# EAGLE schematic rev_001 (EAGLE 9.6.2)
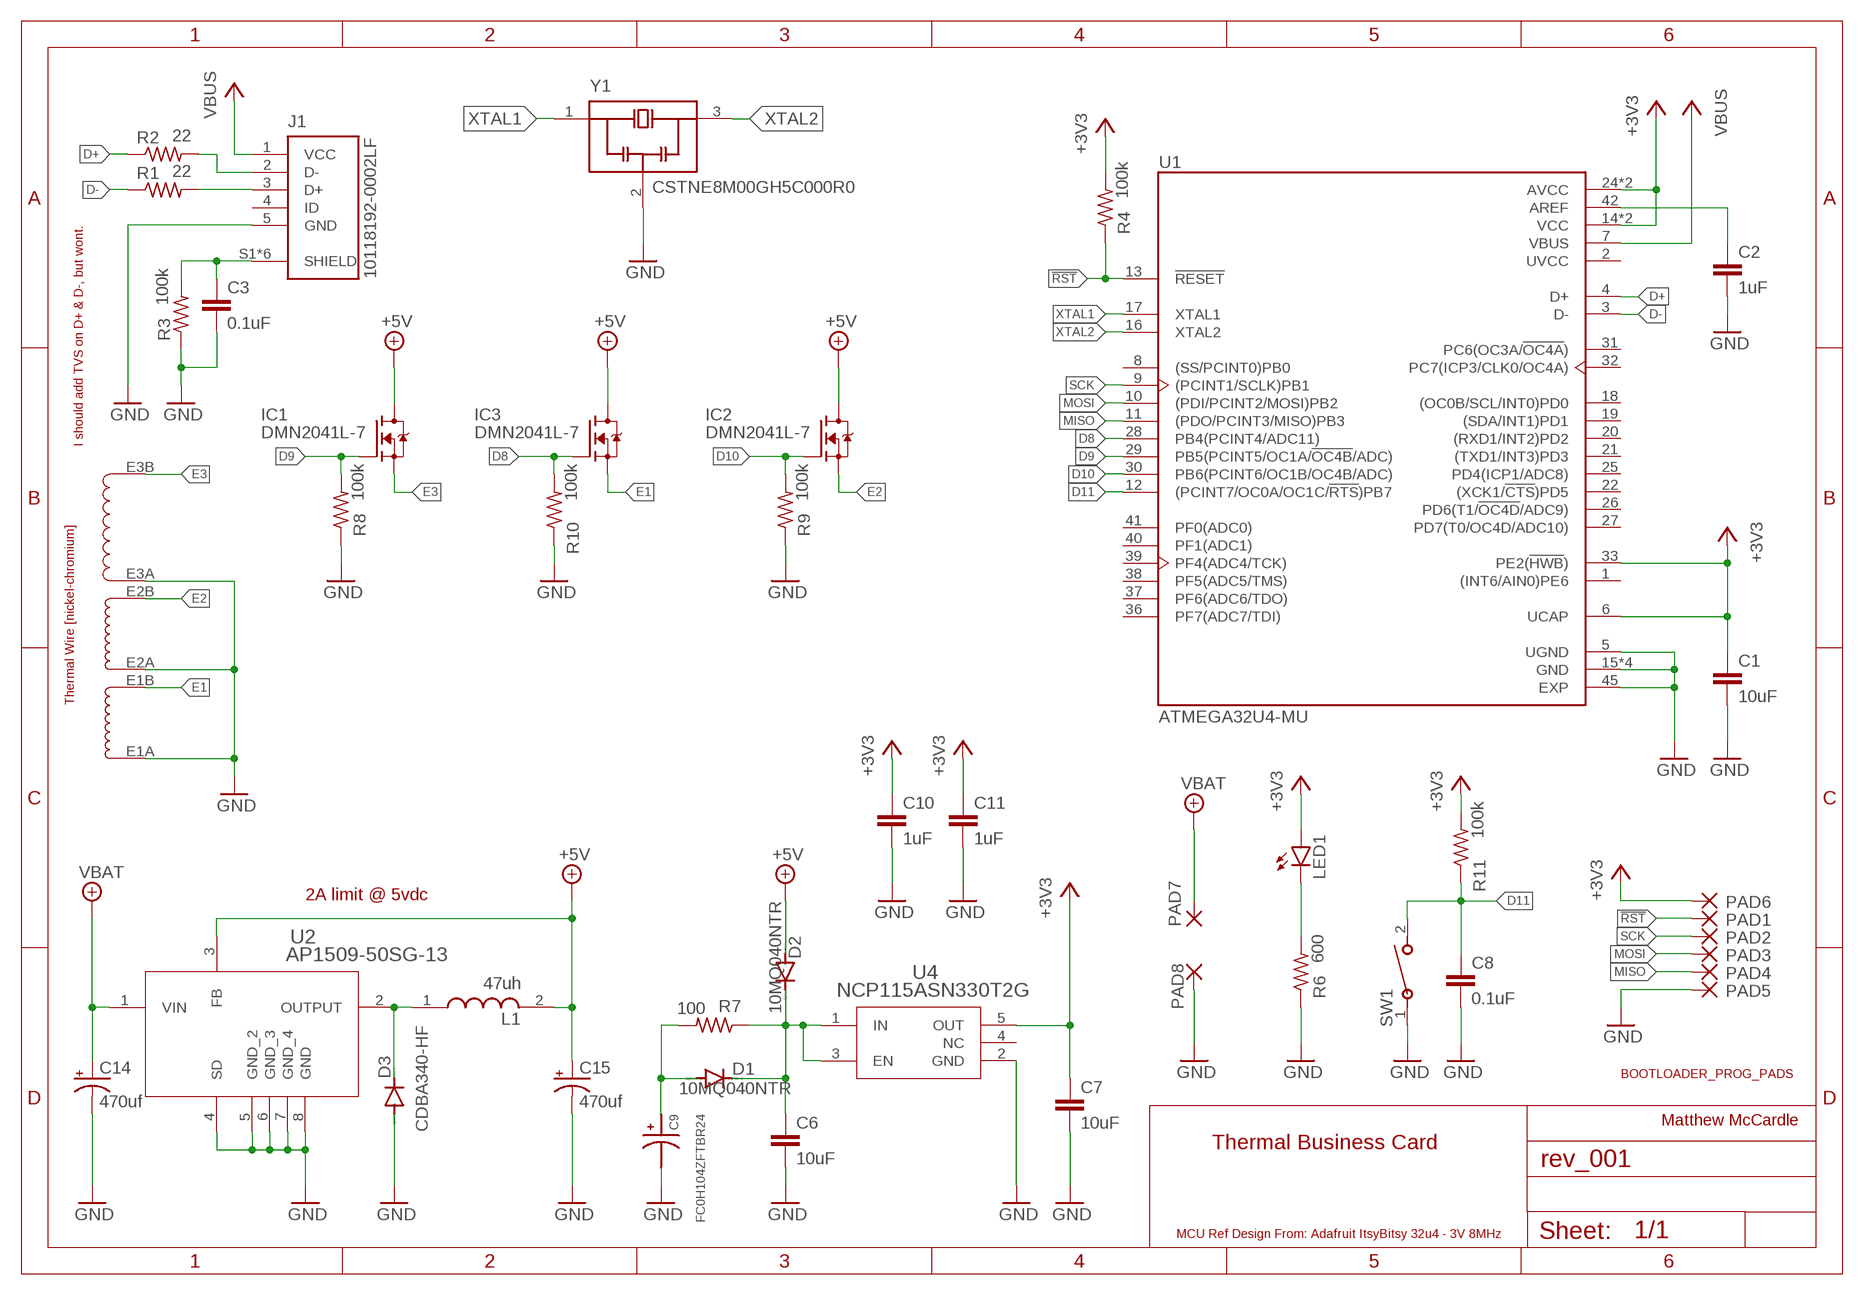
[diagram p0: schematic, sheet 1]

## Parts
C1  10uF  C-EUC0603  [C0603]
C2  1uF  C-EUC0603  [C0603]
C3  0.1uF  C-EUC0603  [C0603]
C6  10uF  C-EUC0603  [C0603]
C7  10uF  C-EUC0603  [C0603]
C8  0.1uF  C-EUC0603  [C0603]
C9  FC0H104ZFTBR24  [CAPAE1080X580N]
C10  1uF  C-EUC0603  [C0603]
C11  1uF  C-EUC0603  [C0603]
C14  470uf  CPOL-USUD-4X5,8  [UD-4X5,8_NICHICON]
C15  470uf  CPOL-USUD-4X5,8  [UD-4X5,8_NICHICON]
D1  10MQ040NTR  DIODE-DO-214AC  [DO-214AC]
D2  10MQ040NTR  DIODE-DO-214AC  [DO-214AC]
D3  CDBA340-HF  DIODE-DO-214AC  [DO-214AC]
IC1  DMN2041L-7  DS31126  [SOT23]
IC2  DMN2041L-7  DS31126  [SOT23]
IC3  DMN2041L-7  DS31126  [SOT23]
J1  10118192-0002LF  [AMPHENOL_10118192-0002LF]
L1  47uh  WUERTH_ELEKTRONIK_7447714470WUERTH_ELEKTRONIK_7447714470_0_0  [WUERTH_ELEKTRONIK_7447714470_0]
LED1  LEDSML0603  [SML0603]
NICR1  HOT_WIRE  [LAYOUT_A]
PAD1  WIREPADSMD1,27-254  [SMD1,27-2,54]
PAD2  WIREPADSMD1,27-254  [SMD1,27-2,54]
PAD3  WIREPADSMD1,27-254  [SMD1,27-2,54]
PAD4  WIREPADSMD1,27-254  [SMD1,27-2,54]
PAD5  WIREPADSMD1,27-254  [SMD1,27-2,54]
PAD6  WIREPADSMD1,27-254  [SMD1,27-2,54]
PAD7  WIREPAD2,54/0,9  [2,54/0,9]
PAD8  WIREPAD2,54/0,9  [2,54/0,9]
R1  22  R-US_R0603  [R0603]
R2  22  R-US_R0603  [R0603]
R3  100k  R-US_R0603  [R0603]
R4  100k  R-US_R0603  [R0603]
R6  600  R-US_R0603  [R0603]
R7  100  R-US_R0603  [R0603]
R8  100k  R-US_R0603  [R0603]
R9  100k  R-US_R0603  [R0603]
R10  100k  R-US_R0603  [R0603]
R11  100k  R-US_R0603  [R0603]
SW1  B3AL-1000P  [SW_B3AL_OMR]
U1  ATMEGA32U4-MU  [QFN50P700X700X100-45N]
U2  AP1509-50SG-13  [SOP-8L_DIO]
U4  NCP115ASN330T2G  [TSOP-5-483-N_ONS]
Y1  CSTNE8M00GH5C000R0  [OSC_CSTNE8M00GH5C000R0]

## Nets
!RST: PAD1.1(P) R4.1 U1.13(!RESET!)
+3V3: C1.1 C7.1 C10.1 C11.1 LED1.A PAD6.1(P) R4.2 R11.2 U1.6(UCAP) U1.14(VCC) U1.24(AVCC) U1.33(PE2(!HWB!)) U1.34(VCC) U1.44(AVCC) U4.5(OUT)
+5V: C15.+ D2.A IC1.D IC2.D IC3.D J1.1(VCC) L1.2 U1.7(VBUS) U2.3(FB) ; supply symbol labelled VBUS
+8V: C14.+ PAD7.1(P) U2.1(VIN) ; supply symbol labelled VBAT
D8: IC3.G R10.2 U1.28(PB4(PCINT4/ADC11))
D9: IC1.G R8.2 U1.29(PB5(PCINT5/OC1A/!OC4B!/ADC))
D10: IC2.G R9.2 U1.30(PB6(PCINT6/OC1B/OC4B/ADC))
D11: C8.1 R11.1 SW1.2 U1.12((PCINT7/OC0A/OC1C/!RTS!)PB7)
D+: R2.1 U1.4(D+)
D-: R1.1 U1.3(D-)
E1: IC3.S NICR1.E1B
E2: IC2.S NICR1.E2B
E3: IC1.S NICR1.E3B
GND: C1.2 C2.2 C3.2 C6.2 C7.2 C8.2 C9.2 C10.2 C11.2 C14.- C15.- D3.A J1.5(GND) NICR1.E1A NICR1.E2A NICR1.E3A PAD5.1(P) PAD8.1(P) R3.1 R6.1 R8.1 R9.1 R10.1 SW1.1 U1.5(UGND) U1.15(GND) U1.23(GND) U1.35(GND) U1.43(GND) U1.45(EXP) U2.4(SD) U2.5(GND_2) U2.6(GND_3) U2.7(GND_4) U2.8(GND) U4.2(GND) Y1.2(GND)
MISO: PAD4.1(P) U1.11((PDO/PCINT3/MISO)PB3)
MOSI: PAD3.1(P) U1.10((PDI/PCINT2/MOSI)PB2)
N$1: J1.3(D+) R1.2
N$2: C2.1 U1.42(AREF)
N$3: J1.2(D-) R2.2
N$4: C3.1 J1.S1(SHIELD) J1.S2(SHIELD) J1.S3(SHIELD) J1.S4(SHIELD) J1.S5(SHIELD) J1.S6(SHIELD) R3.2
N$6: LED1.C R6.2
N$7: D3.C L1.1 U2.2(OUTPUT)
N$9: C9.1 D1.A R7.2
N$10: C6.1 D1.C D2.C R7.1 U4.1(IN) U4.3(EN)
SCK: PAD2.1(P) U1.9((PCINT1/SCLK)PB1)
XTAL1: U1.17(XTAL1) Y1.1(IN)
XTAL2: U1.16(XTAL2) Y1.3(OUT)
Unconnected: J1.4(ID) U1.1((INT6/AIN0)PE6) U1.8((SS/PCINT0)PB0) U1.18((OC0B/SCL/INT0)PD0) U1.19((SDA/INT1)PD1) U1.20((RXD1/INT2)PD2) U1.21((TXD1/INT3)PD3) U1.22((XCK1/!CTS!)PD5) U1.25(PD4(ICP1/ADC8)) U1.26(PD6(T1/!OC4D!/ADC9)) U1.27(PD7(T0/OC4D/ADC10)) U1.31(PC6(OC3A/!OC4A!)) U1.32(PC7(ICP3/CLK0/OC4A)) U1.36(PF7(ADC7/TDI)) U1.37(PF6(ADC6/TDO)) U1.38(PF5(ADC5/TMS)) U1.39(PF4(ADC4/TCK)) U1.40(PF1(ADC1)) U1.41(PF0(ADC0)) U4.4(NC)

## Notes on the sheet
- I should add TVS on D+ & D-, but wont.
- Thermal Wire [nickel-chromium]
- 2A limit @ 5vdc
- BOOTLOADER_PROG_PADS
- Matthew McCardle
- Thermal Business Card
- MCU Ref Design From: Adafruit ItsyBitsy 32u4 - 3V 8MHz

## Power pins joined to a net without a drawn wire
UVCC: U1.2(UVCC)

## Library data of the parts
C1-C3 C6-C8 C10 C11 = rcl:C-EU: CAPACITOR, European symbol; SPICEPREFIX: C
C9 = FC0H104ZFTBR24:FC0H104ZFTBR24: 100mF (EDLC) Supercapacitor 5.5V Radial, Can - SMD 25Ohm @ 1kHz; DESCRIPTION: 100 mF (EDLC) Supercapacitor 5.5 V Radial, Can - SMD 25Ohm @ 1kHz -; DIGI-KEY_PART_NUMBER: 399-10939-1-ND; MF: KEMET; MP: FC0H104ZFTBR24; PACKAGE: Radial KEMET; PURCHASE-URL: https://pricing.snapeda.com/search/part/FC0H104ZFTBR24/?ref=eda
C14 C15 = rcl:CPOL-US: POLARIZED CAPACITOR, American symbol; SPICEPREFIX: C
D1-D3 = diode:DIODE-: DIODE
IC1-IC3 = ds31126:DS31126
J1 = 10118192-0002LF:10118192-0002LF: USB - micro B USB 2.0 Receptacle Connector 5 Position Surface Mount, Right Angle; DESCRIPTION: Micro USB 2.0, Input Output Connectors, B TYPE RECEPTACLE without flange; DIGI-KEY_PART_NUMBER: 609-5379-1-ND; MF: Amphenol ICC (FCI); MP: 10118192-0002LF; PACKAGE: None; PURCHASE-URL: https://pricing.snapeda.com/search/part/10118192-0002LF/?ref=eda
L1 = Wuerth Elektronik - 7447714470:WUERTH_ELEKTRONIK_7447714470: PAS-IND-INDUCTOR-2; CIIVA_IDS: 915979; COMPONENT_LINK_1_DESCRIPTION: Manufacturer URL; COMPONENT_LINK_1_URL: http://www.we-online.com; DATASHEET: http://www.we-online.de/katalog/media/pdf/7447714470.pdf; FOOTPRINT_VARIANT_NAME_0: Manufacturer Recommended; IMPORTED: yes; IMPORTED_FROM: vault; IMPORT_TS: 1521856198; INDUCTANCE: 47.0 ÂμH; MF: Wuerth Elektronik; MPN: 7447714470; PACKAGE: WE-PD 1050; PREFIX: L; RELEASE_DATE: 1421213129; VAULT_GUID: FE1E0539-D7B8-47D2-B165-CDB821875268; VAULT_REVISION: 96EBAD48-BC36-43BE-89C9-ECB802C4CC0C
LED1 = led:LED: LED OSRAM: - CHIPLED LG R971, LG N971, LY N971, LG Q971, LY Q971, LO R971, LY R971 LH N974, LH R974 LS Q976, LO Q976, LY Q976 LO Q996 - Hyper CHIPLED LW Q18S LB Q993, LB Q99A, LB R99A - SideLED LS A670, LO A670, LY A670, LG A670, LP A670 LB A673, LV A673, LT A673, LW A673 LH A674 LY A675 LS A676, LA A676, LO A676, LY A676, LW A676 LS A679, LY A679, LG A679 - Hyper Micro SIDELED® LS Y876, LA Y876, LO Y876, LY Y876 LT Y87S - SmartLED LW L88C, LW L88S LB L89C, LB L89S, LG L890 LS L89K, LO L89K, LY L89K LS L896, LA L896, LO L896, LY L896 - TOPLED LS T670, LO T670, LY T670, LG T670, LP T670 LSG T670, LSP T670, LSY T670, LOP T670, LYG T670 LG T671, LOG T671, LSG T671 LB T673, LV T673, LT T673, LW T673 LH T674 LS T676, LA T676, LO T676, LY T676, LB T676, LH T676, LSB T676, LW T676 LB T67C, LV T67C, LT T67C, LS T67K, LO T67K, LY T67K, LW E67C LS E67B, LA E67B, LO E67B, LY E67B, LB E67C, LV E67C, LT E67C LW T67C LS T679, LY T679, LG T679 LS T770, LO T770, LY T770, LG T770, LP T770 LB T773, LV T773, LT T773, LW T773 LH T774 LS E675, LA E675, LY E675, LS T675 LS T776, LA T776, LO T776, LY T776, LB T776 LHGB T686 LT T68C, LB T68C - Hyper Mini TOPLED® LB M676 - Mini TOPLED Santana® LG M470 LS M47K, LO M47K, LY M47K Source: http://www.osram.convergy.de LUXEON: - LUMILED® LXK2-PW12-R00, LXK2-PW12-S00, LXK2-PW14-U00, LXK2-PW14-V00 LXK2-PM12-R00, LXK2-PM12-S00, LXK2-PM14-U00 LXK2-PE12-Q00, LXK2-PE12-R00, LXK2-PE12-S00, LXK2-PE14-T00, LXK2-PE14-U00 LXK2-PB12-K00, LXK2-PB12-L00, LXK2-PB12-M00, LXK2-PB14-N00, LXK2-PB14-P00, LXK2-PB14-Q00 LXK2-PR12-L00, LXK2-PR12-M00, LXK2-PR14-Q00, LXK2-PR14-R00 LXK2-PD12-Q00, LXK2-PD12-R00, LXK2-PD12-S00 LXK2-PH12-R00, LXK2-PH12-S00 LXK2-PL12-P00, LXK2-PL12-Q00, LXK2-PL12-R00 Source: www.luxeon.com KINGBRIGHT: KA-3528ASYC Source: www.kingbright.com
NICR1 = logo_wire:HOT_WIRE
PAD1-PAD8 = wirepad:WIREPAD: Wire PAD connect wire on PCB
R1-R4 R6-R11 = rcl:R-US_: RESISTOR, American symbol; SPICEPREFIX: R
SW1 = ul_B3AL-1000P:B3AL-1000P; COPYRIGHT: Copyright (C) 2021 Ultra Librarian. All rights reserved.; DIGI-KEY_PART_NUMBER_1: SW1216TR-ND; DIGI-KEY_PART_NUMBER_2: SW1216CT-ND; DIGI-KEY_PART_NUMBER_3: SW1216DKR-ND; MANUFACTURER_PART_NUMBER: B3AL-1000P; MFR_NAME: Omron
U1 = ATMEGA32U4-MU:ATMEGA32U4-MU: 8-bit Microcontrollers - MCU AVR USB 32K FLASH INDUSTRIA; DESCRIPTION: AVR AVR® ATmega Microcontroller IC 8-Bit 16MHz 32KB (16K x 16) FLASH 44-VQFN (7x7); DIGI-KEY_PART_NUMBER: 2156-ATMEGA32U4-MUR-ND; MF: Microchip Technology / Atmel; MP: ATMEGA32U4-MU; PACKAGE: VFQFN-44 Microchip Technology / Atmel; PURCHASE-URL: https://pricing.snapeda.com/search/part/ATMEGA32U4-MU/?ref=eda
U2 = ul_AP1509-50SG-13:AP1509-50SG-13; COPYRIGHT: Copyright (C) 2021 Ultra Librarian. All rights reserved.; DIGI-KEY_PART_NUMBER_1: AP1509-50SGDICT-ND; DIGI-KEY_PART_NUMBER_2: AP1509-50SGDIDKR-ND; DIGI-KEY_PART_NUMBER_3: AP1509-50SGDITR-ND; MANUFACTURER_PART_NUMBER: AP1509-50SG-13; MFR_NAME: Diodes Inc
U4 = ul_NCP115ASN330T2G:NCP115ASN330T2G; COPYRIGHT: Copyright (C) 2021 Ultra Librarian. All rights reserved.; DIGI-KEY_PART_NUMBER_1: NCP115ASN330T2GOSTR-ND; DIGI-KEY_PART_NUMBER_2: NCP115ASN330T2GOSCT-ND; DIGI-KEY_PART_NUMBER_3: NCP115ASN330T2GOSDKR-ND; DIGI-KEY_PART_NUMBER_4: 2156-NCP115ASN330T2G-OS-ND; MANUFACTURER_PART_NUMBER: NCP115ASN330T2G; MFR_NAME: onsemi
Y1 = CSTNE8M00GH5C000R0:CSTNE8M00GH5C000R0: 8MHz Ceramic Resonator Built in Capacitor 33pF ±0.13% 40 Ohms -40°C ~ 125°C Surface Mount; DESCRIPTION: 8 MHz Ceramic Resonator Built in Capacitor 33 pF ±0.13% 40 Ohms -40°C ~ 125°C Surface Mount; DIGI-KEY_PART_NUMBER: 490-17961-1-ND; MF: Murata; MP: CSTNE8M00GH5C000R0; PACKAGE: SMD-3 Murata; PURCHASE-URL: https://pricing.snapeda.com/search/part/CSTNE8M00GH5C000R0/?ref=eda